# EAGLE design budzik (EAGLE 7.7.0)
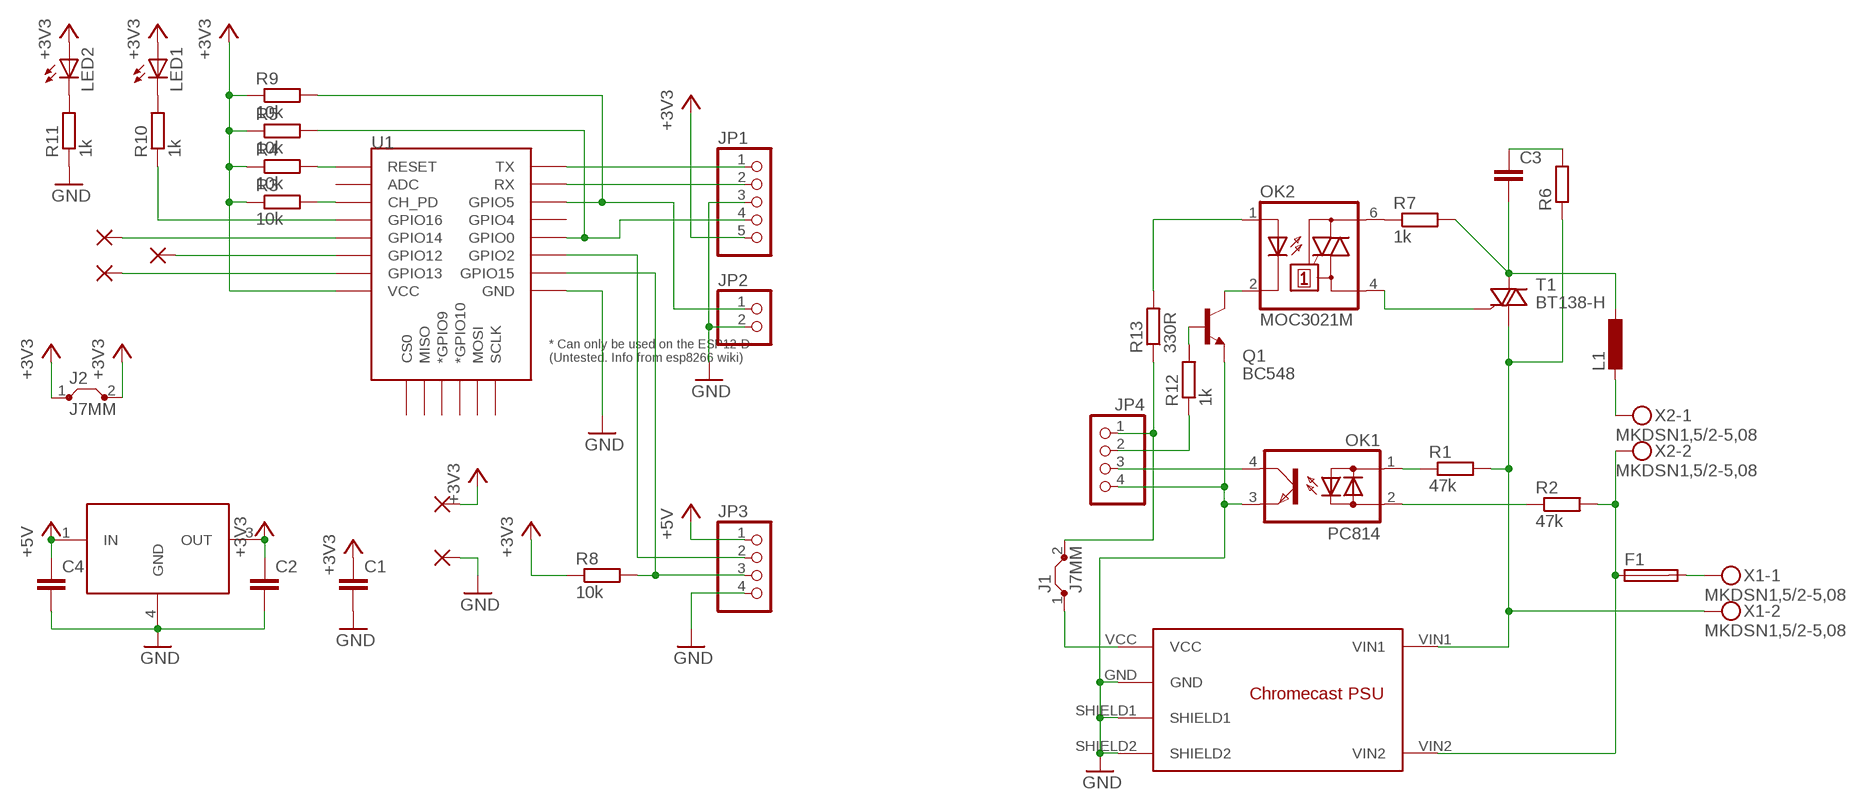
[diagram p0: schematic, sheet 1]

## Parts
C1  C-EUC1206  [C1206]
C2  C-EUC1206K  [C1206K]
C3  C-EU075-063X106  [C075-063X106]
C4  C-EUC1206K  [C1206K]
F1  TR5  [TR5]
J1  J7MM  [07]
J2  J7MM  [07]
JP1  PINHD-1X5  [1X05]
JP2  PINHD-1X2  [1X02]
JP3  PINHD-1X4  [1X04]
JP4  PINHD-1X4  [1X04]
L1  L-EU6000-XXX-RC  [6000-XXXX-RC]
LED1  LEDSML0805  [SML0805]
LED2  LEDSML0805  [SML0805]
OK1  PC814  [DIL04]
OK2  MOC3021M  [DIL06]
PAD1  WIREPAD2,15/1,0  [2,15/1,0]
PAD2  WIREPAD2,15/1,0  [2,15/1,0]
PAD3  WIREPAD2,15/1,0  [2,15/1,0]
PAD4  WIREPAD2,15/1,0  [2,15/1,0]
PAD5  WIREPAD2,15/1,0  [2,15/1,0]
Q1  BC548  [TO92-EBC]
R1  47k  R-EU_0204/7  [0204/7]
R2  47k  R-EU_0204/7  [0204/7]
R3  10k  R-EU_R0805  [R0805]
R4  10k  R-EU_R0805  [R0805]
R5  10k  R-EU_R0805  [R0805]
R6  R-EU_0411/3V  [0411V]
R7  1k  R-EU_0204/7  [0204/7]
R8  10k  R-EU_R0805  [R0805]
R9  10k  R-EU_R0805  [R0805]
R10  1k  R-EU_R0805  [R0805]
R11  1k  R-EU_R0805  [R0805]
R12  1k  R-EU_R0805  [R0805]
R13  330R  R-EU_R0805  [R0805]
T1  BT138-H  [TO220BH]
U1  ESP12ESMD  [ESP12E-SMD]
U$1  CHROMECAST-PSU  [CHROMECAST-PSU-UPSIDE-DOWN]
U$2  LF33A  [DPAK]
X1  MKDSN1,5/2-5,08  [MKDSN1,5/2-5,08]
X2  MKDSN1,5/2-5,08  [MKDSN1,5/2-5,08]

## Nets
+3V3: C1.1 C2.1 J2.1 J2.2 JP1.5 LED1.A LED2.A PAD4.1(P) R3.1 R4.1 R5.1 R8.1 R9.1 U1.VCC U$2.3(OUT)
+5V: C4.1 JP3.1 U$2.1(IN)
GND: C1.2 C2.2 C4.2 JP1.3 JP2.2 JP3.4 JP4.4 OK1.3(E) PAD5.1(P) Q1.E R11.1 U1.GND U$1.GND U$1.SHIELD1 U$1.SHIELD2 U$2.4(GND)
N$1: C3.2 L1.1 R7.2 T1.T2(A2)
N$2: OK2.4(A1) T1.G
N$3: F1.2 X1.1
N$4: R1.2 R6.1 T1.T1(A1) U$1.VIN1 X1.2
N$5: OK1.1(AC1) R1.1
N$6: OK1.2(AC2) R2.1
N$7: JP1.1 U1.TXD0(TX)
N$8: JP1.2 U1.RXD0(RX)
N$9: R3.2 U1.CH_PD
N$10: JP1.4 R5.2 U1.GPIO0
N$11: R4.2 U1.RESET
N$12: F1.1 R2.2 U$1.VIN2 X2.2
N$13: JP4.3 OK1.4(C)
N$14: JP3.3 R8.2 U1.GPIO15
N$15: J1.2 JP4.1 R13.1
N$16: C3.1 R6.2
N$17: OK2.6(A2) R7.1
N$18: OK2.2(C) Q1.C
N$19: L1.2 X2.1
N$20: OK2.1(A) R13.2
N$21: JP2.1 R9.2 U1.GPIO5
N$22: PAD1.1(P) U1.GPIO13
N$23: PAD2.1(P) U1.GPIO14
N$24: PAD3.1(P) U1.GPIO12
N$25: LED1.C R10.2
N$26: R10.1 U1.GPIO16
N$27: LED2.C R11.2
N$28: JP4.2 R12.1
N$29: Q1.B R12.2
N$30: JP3.2 U1.GPIO2
N$31: J1.1 U$1.VCC
Unconnected: U1.ADC U1.CS0 U1.GPIO4 U1.GPIO9(*GPIO9) U1.GPIO10(*GPIO10) U1.MISO U1.MOSI U1.SCLK

## Library data of the parts
C1 C2 C4 = rcl:C-EU: CAPACITOR, European symbol
C3 = resistor:C-EU: CAPACITOR, European symbol
F1 = fuse:TR5: FUSE Wickmann; OC_FARNELL: unknown; OC_NEWARK: unknown
J1 J2 = jumper:J: Bridge
JP1 = pinhead:PINHD-1X5: PIN HEADER
JP2 = pinhead:PINHD-1X2: PIN HEADER
JP3 JP4 = pinhead:PINHD-1X4: PIN HEADER
L1 = rcl:L-EU: INDUCTOR, European symbol
LED1 LED2 = led:LED: LED OSRAM: - CHIPLED LG R971, LG N971, LY N971, LG Q971, LY Q971, LO R971, LY R971 LH N974, LH R974 LS Q976, LO Q976, LY Q976 LO Q996 - Hyper CHIPLED LW Q18S LB Q993, LB Q99A, LB R99A - SideLED LS A670, LO A670, LY A670, LG A670, LP A670 LB A673, LV A673, LT A673, LW A673 LH A674 LY A675 LS A676, LA A676, LO A676, LY A676, LW A676 LS A679, LY A679, LG A679 - Hyper Micro SIDELED® LS Y876, LA Y876, LO Y876, LY Y876 LT Y87S - SmartLED LW L88C, LW L88S LB L89C, LB L89S, LG L890 LS L89K, LO L89K, LY L89K LS L896, LA L896, LO L896, LY L896 - TOPLED LS T670, LO T670, LY T670, LG T670, LP T670 LSG T670, LSP T670, LSY T670, LOP T670, LYG T670 LG T671, LOG T671, LSG T671 LB T673, LV T673, LT T673, LW T673 LH T674 LS T676, LA T676, LO T676, LY T676, LB T676, LH T676, LSB T676, LW T676 LB T67C, LV T67C, LT T67C, LS T67K, LO T67K, LY T67K, LW E67C LS E67B, LA E67B, LO E67B, LY E67B, LB E67C, LV E67C, LT E67C LW T67C LS T679, LY T679, LG T679 LS T770, LO T770, LY T770, LG T770, LP T770 LB T773, LV T773, LT T773, LW T773 LH T774 LS E675, LA E675, LY E675, LS T675 LS T776, LA T776, LO T776, LY T776, LB T776 LHGB T686 LT T68C, LB T68C - Hyper Mini TOPLED® LB M676 - Mini TOPLED Santana® LG M470 LS M47K, LO M47K, LY M47K Source: http://www.osram.convergy.de LUXEON: - LUMILED® LXK2-PW12-R00, LXK2-PW12-S00, LXK2-PW14-U00, LXK2-PW14-V00 LXK2-PM12-R00, LXK2-PM12-S00, LXK2-PM14-U00 LXK2-PE12-Q00, LXK2-PE12-R00, LXK2-PE12-S00, LXK2-PE14-T00, LXK2-PE14-U00 LXK2-PB12-K00, LXK2-PB12-L00, LXK2-PB12-M00, LXK2-PB14-N00, LXK2-PB14-P00, LXK2-PB14-Q00 LXK2-PR12-L00, LXK2-PR12-M00, LXK2-PR14-Q00, LXK2-PR14-R00 LXK2-PD12-Q00, LXK2-PD12-R00, LXK2-PD12-S00 LXK2-PH12-R00, LXK2-PH12-S00 LXK2-PL12-P00, LXK2-PL12-Q00, LXK2-PL12-R00 Source: www.luxeon.com KINGBRIGHT: KA-3528ASYC Source: www.kingbright.com
OK1 = optocoupler:PC814: SHARP OPTO COUPLER; OC_FARNELL: 9707662; OC_NEWARK: unknown
OK2 = optocoupler:MOC30*M: RANDOM-PHASE OPTOISOLATORS TRIAC DRIVER OUTPUT Source: http://www.fairchildsemi.com MOC3020-M.pdf; MF: FAIRCHILD SEMICONDUCTOR; MPN: MOC3021-M; OC_FARNELL: 1021365; OC_NEWARK: 95B7895
PAD1-PAD5 = wirepad:WIREPAD: Wire PAD connect wire on PCB
Q1 = transistor-npn:BC548*: NPN Transistor
R1-R5 R7-R13 = rcl:R-EU_: RESISTOR, European symbol
R6 = resistor:R-EU_: RESISTOR, European symbol
T1 = triac:BT138: TRIAC Source: http://www.semiconductors.philips.com BT138_SERIES_2.pdf
U1 = esp8266modules:ESP12E: ESP12E Module
U$1 = chromecast-psu:CHROMECAST-PSU
U$2 = chromecast-psu:LF33A
X1 X2 = con-phoenix-508:MKDSN1,5/2-5,08: MKDSN 1,5/ 2-5,08 Printklemme Nennstrom: 13,5 A Nennspannung: 250 V Rastermaß: 5,08 mm Polzahl: 2 Anschlussart: Schraubanschluss Montage: Löten Anschlussrichtung Leiter/Platine: 0 ° Artikelnummer: 1729128 Source: http://eshop.phoenixcontact.com .. 1729128.pdf

## Board
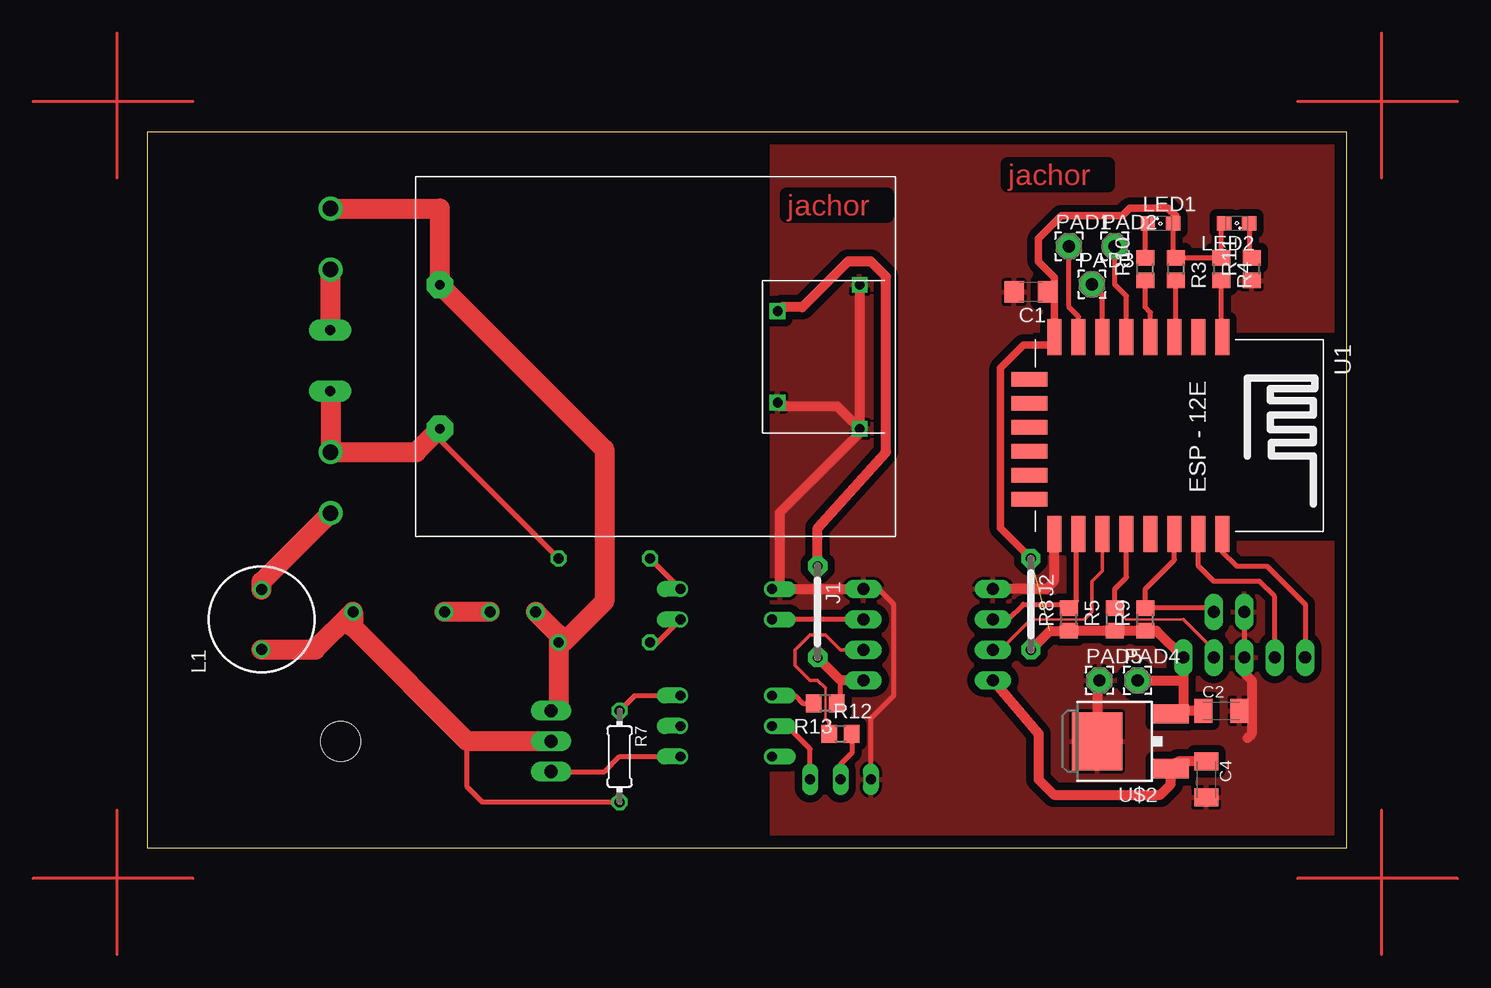
[diagram p1: board, top side]
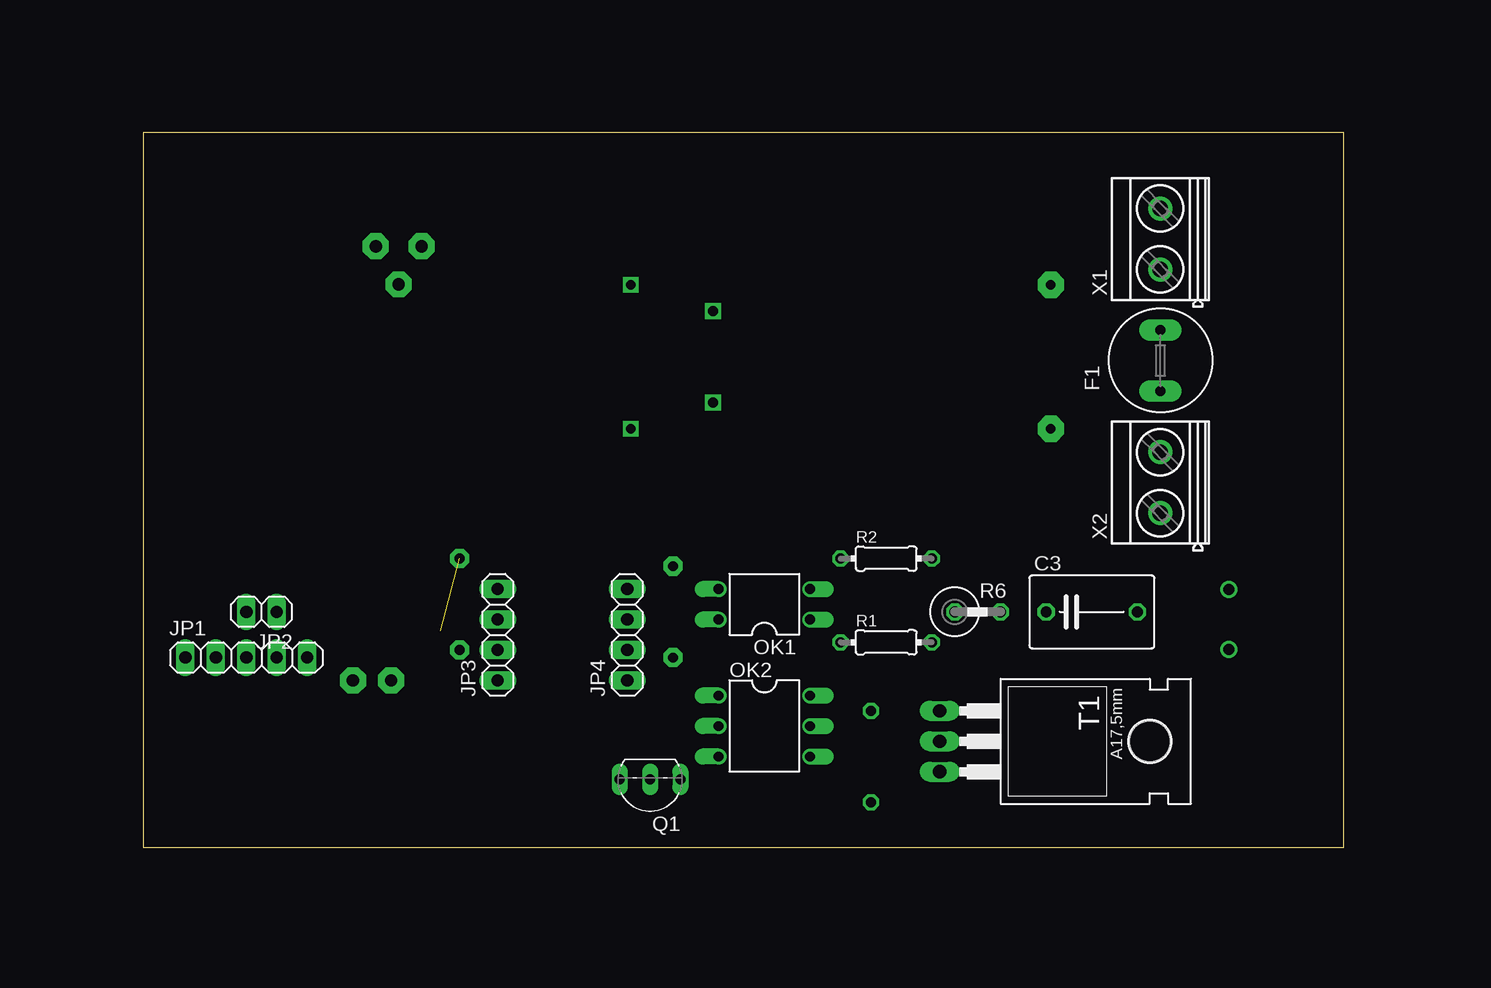
[diagram p2: board, bottom side, seen from below]

Size 100 x 59.68 mm. Coordinates in mm from the lower left corner, seen from the top.
Outline: 0,0 100,0 100,59.68 0,59.68 0,0
Copper layers (1*16): Top 0.035mm / dielectric 1.5mm / Bottom 0.035mm
Design rules "default": minimum track width 10mil, minimum drill 24mil, track to track 8mil, track to pad 8mil, pad to pad 8mil, via to via 8mil, smd to smd 8mil, copper to edge 40mil, drill to drill 8mil, minimum pad ring 10mil, minimum via ring 8mil, stop-mask expansion 4mil, vias tented up to drill 0mil, thermal gap 10mil
tRestrict: area 45.7,0 to 50.8,59.7

### Footprints (pad centres in the part's own frame; a part is rotated, then mirrored left to right if it is on the bottom)
C1206 = smd 1.6 x 1.8: 1 -1.4,0; 2 1.4,0
C1206K = smd 1.5 x 2: 1 -1.5,0; 2 1.5,0
C075-063X106 = drill 0.914 octagon: 1 -3.81,0; 2 3.81,0
TR5 = drill 0.813 pad 1.778 long: 1 -2.54,0; 2 2.54,0
07 = drill 0.813 pad 1.6 octagon: 1 -3.81,0; 2 3.81,0
1X05 = drill 1.016 long: 1 -5.08,0; 2 -2.54,0; 3 0,0; 4 2.54,0; 5 5.08,0
1X02 = drill 1.016 long: 1 -1.27,0; 2 1.27,0
1X04 = drill 1.016 long: 1 -3.81,0; 2 -1.27,0; 3 1.27,0; 4 3.81,0
6000-XXXX-RC = drill 0.9 pad 1.422: 1 -2.5,0; 2 2.5,0
SML0805 = smd 1.2 x 1.2: A 1.05,0; C -1.05,0
DIL04 = drill 0.813 offset: 1 -1.27,-3.81; 2 1.27,-3.81; 3 1.27,3.81; 4 -1.27,3.81
DIL06 = drill 0.813 offset: 1 -2.54,-3.81; 2 0,-3.81; 3 2.54,-3.81; 4 2.54,3.81; 5 0,3.81; 6 -2.54,3.81
2,15/1,0 = drill 1.016 pad 2.159 octagon: 1 0,0
TO92-EBC = drill 0.813 long: B 0,-1.27; C -2.54,-1.27; E 2.54,-1.27
0204/7 = drill 0.813 octagon: 1 -3.81,0; 2 3.81,0
R0805 = smd 1.3 x 1.5: 1 -0.95,0; 2 0.95,0
0411V = drill 0.914 octagon: 1 -2.54,0; 2 1.27,0
TO220BH = drill 1.118 long: G 2.54,-6.35; T1 -2.54,-6.35; T2 0,-6.35 | hole 3.302: 0,11.176
ESP12E-SMD = smd 3 x 1.2: ADC -8.3,3.8; CH_PD -8.3,1.8; GND 8.1,-8.2; GPIO0 8.1,-2.2; GPIO2 8.1,-4.2; GPIO4 8.1,-0.2; GPIO5 8.1,1.8; GPIO12 -8.3,-4.2; GPIO13 -8.3,-6.2; GPIO14 -8.3,-2.2; GPIO15 8.1,-6.2; GPIO16 -8.3,-0.2; RESET -8.3,5.8; RXD0 8.1,3.8; TXD0 8.1,5.8; VCC -8.3,-8.2 | smd 1.2 x 3: CS0 -4.8,-10.3; GPIO9 -0.8,-10.3; GPIO10 1.2,-10.3; MISO -2.8,-10.3; MOSI 3.2,-10.3; SCLK 5.2,-10.3
CHROMECAST-PSU-UPSIDE-DOWN = drill 0.8 square: GND 10.16,-3.81; SHIELD1 17,6; SHIELD2 17,-6; VCC 10.16,3.81 | drill 0.8 pad 2.184 octagon: VIN1 -18,6; VIN2 -18,-6
DPAK = smd 1.6 x 3: 1 -2.28,-4.04; 3 2.28,-4.04 | smd 4.826 x 4.191: 4 0,2.096
MKDSN1,5/2-5,08 = drill 1.3 pad 2: 1 -2.561,0.025; 2 2.519,0.025

### Placement (x,y rotation side)
C1  73.66,46.35 180 top
C2  89.53,11.43 0 top
C3  20.95,19.69 0 bottom
C4  88.27,5.71 270 top
F1  15.24,40.64 90 bottom
J1  55.88,19.69 270 top
J2  73.66,20.32 270 top
JP1  91.44,15.88 0 bottom
JP2  90.17,19.69 180 bottom
JP3  70.48,17.78 90 bottom
JP4  59.69,17.78 90 bottom
L1  9.53,19.05 90 top
LED1  84.45,52.07 0 top
LED2  90.81,52.07 180 top
OK1  48.26,20.32 90 bottom
OK2  48.26,10.16 270 bottom
PAD1  76.83,50.16 0 top
PAD2  80.64,50.16 0 top
PAD3  78.74,46.99 0 top
PAD4  82.55,13.97 0 top
PAD5  79.38,13.97 0 top
Q1  57.78,4.45 180 bottom
R1  38.1,17.15 0 bottom
R2  38.1,24.13 0 bottom
R3  85.72,48.26 270 top
R4  89.53,48.26 270 top
R5  80.64,19.05 90 top
R6  29.84,19.69 0 bottom
R7  39.37,7.62 270 top
R8  76.83,19.05 90 top
R9  83.19,19.05 90 top
R10  83.19,48.26 90 top
R11  92.08,48.26 90 top
R12  57.78,9.52 0 top
R13  56.52,12.06 180 top
T1  27.3,8.89 270 bottom
U1  83.82,34.29 270 top
U$1  42.38,40.95 0 top
U$2  81.28,8.89 90 top
X1  15.24,50.8 90 bottom
X2  15.24,30.48 90 bottom

### Tracks (layer width: path | path; a pad name or v marks a point on that pad's centre or on a via)
+3V3  (1 unrouted)
  Top 0.406: LED1.A 85.5,49.43 R3.1 R4.1 89.53,51.85 LED2.A | C1.1 75.62,46.68 75.62,46.99
  Top 0.61: LED1.A 85.72,52.29 85.72,52.71 85.09,53.34 81.92,53.34 81.28,52.71 76.2,52.71 74.3,50.8 74.3,48.9 75.62,47.57 75.62,46.99 U1.VCC 75.62,41.96 75.56,41.91 73.03,41.91 71.12,40.01 71.12,26.67 J2.1
  Top 0.813: J2.2 75.25,18.1 R8.1 R5.1 R9.1 84.14,18.1 JP1.5 86.36,13.97 | 86.36,13.97 86.36,11.16 U$2.3 85.58,11.43 C2.1 | PAD4.1 86.36,13.97
+5V
  Top 0.813: JP3.1 74.3,9.52 74.3,5.71 75.56,4.45 84.45,4.45 85.32,5.31 U$2.1 85.92,7.21 C4.1
GND
  Top 0.406: JP2.2 JP1.3 | Q1.E 60.33,10.79 62.23,12.7 62.23,20.32 60.96,21.59 JP4.4
  Top 0.813: U1.GND 75.56,26.13 75.56,22.23 74.93,21.59 JP3.4 | PAD5.1 79.18,13.78 U$2.4 | JP1.3 91.44,14.6 92.08,13.97 92.08,9.52 91.71,9.16 | U$1.SHIELD1 U$1.SHIELD2 | U$1.GND 52.54,36.99 52.7,36.83 57.5,36.83 U$1.SHIELD2 | OK1.3 52.7,21.59 | 52.7,21.59 JP4.4 | U$1.SHIELD2 59.38,34.62 52.7,27.94 52.7,21.59
  pour Top (isolate 0.61): 73.66,43.18 101.6,43.18 101.6,60.96 52.07,60.96 52.07,-1.91 101.6,-1.91 101.6,25.4 73.66,25.4
N$1
  Top 0.406: R7.2 27.94,3.81 26.67,5.08 26.67,8.89
  Top 1.676: T1.T2 26.67,8.89 17.14,18.41 C3.2 14.01,16.55 L1.1
N$2
  Top 0.406: T1.G 38.1,6.35 39.37,7.62 OK2.4
N$3
  Top 1.676: X1.1 15.24,48.24 F1.2
N$4
  Top 1.676: X1.2 24.38,53.32 U$1.VIN1 38.1,33.23 38.1,20.56 34.68,17.15 R1.2 | R6.1 34.29,17.78 R1.2 | R1.2 34.29,11.43 T1.T1
N$5
  Top 0.406: R1.1 42.55,17.15 OK1.1
N$6
  Top 0.406: R2.1 OK1.2
N$7
  Top 0.406: U1.TXD0 89.53,26.1 89.53,24.77 90.81,23.49 93.34,23.49 96.52,20.32 JP1.1
N$8
  Top 0.406: JP1.2 93.98,20.95 92.71,22.23 88.9,22.23 87.62,23.51 U1.RXD0
N$9
  Top 0.406: U1.CH_PD 85.72,42.7 R3.2
N$10
  Top 0.229: R5.2 81.59,19.05 86.36,19.05
  Top 0.305: 86.36,19.05 88.9,16.51 JP1.4
  Top 0.406: R5.2 80.64,21.59 81.62,22.56 U1.GPIO0
N$11
  Top 0.406: U1.RESET 89.53,42.67 R4.2
N$12
  Top 0.406: U$1.VIN2 24.38,34.04 R2.2
  Top 1.676: F1.1 15.27,38.1 X2.2 22.43,33 U$1.VIN2
N$13
  Top 0.406: JP4.3 OK1.4
N$14
  Top 0.406: U1.GPIO15 77.62,25.55 77.47,25.4 77.47,20.63 R8.2 76.83,20.32 73.03,20.32 71.75,19.05 JP3.3
N$15
  Top 0.406: R13.1 57.78,12.38 57.78,13.97
  Top 0.813: JP4.1 57.78,13.97 J1.2
N$16
  Top 1.676: R6.2 C3.1
N$17
  Top 0.406: R7.1 40.64,12.7 OK2.6
N$18
  Top 0.406: Q1.C 55.24,8.25 53.34,10.16 OK2.2
N$19
  Top 1.676: L1.2 9.53,22.18 X2.1
N$20
  Top 0.406: OK2.1 53.98,12.7 54.61,12.06 R13.2
N$21
  Top 0.406: U1.GPIO5 85.62,24.02 83.19,21.59 R9.2 88.58,20 JP2.1
N$22
  Top 0.406: U1.GPIO13 77.62,44.3 76.83,45.09 PAD1.1
N$23
  Top 0.406: U1.GPIO14 81.62,46.01 80.64,46.99 PAD2.1
N$24
  Top 0.406: U1.GPIO12 79.62,46.11 PAD3.1
N$25
  Top 0.406: R10.2 83.19,51.85 LED1.C
N$26
  Top 0.406: U1.GPIO16 83.62,44.65 83.19,45.09 R10.1
N$27
  Top 0.406: LED2.C 91.86,49.43 R11.2
N$28
  Top 0.229: 56.52,10.79 56.52,13.34
  Top 0.305: R12.1 56.84,10.48 56.52,10.79 | JP4.2 57.78,16.51 56.52,17.78 55.24,17.78 53.98,16.51 53.98,15.24 55.24,13.97 55.88,13.97 56.52,13.34
N$29
  Top 0.406: R12.2 58.73,7.93 57.78,6.98 Q1.B
N$30
  Top 0.229: 73.66,19.05 78.11,19.05
  Top 0.305: JP3.2 71.12,16.51 73.66,19.05 | 78.11,19.05 78.74,19.69 78.74,22.23 79.62,23.1 U1.GPIO2
N$31
  Top 0.813: J1.1 55.88,26.67 61.59,33.02 61.59,47.62 60.33,48.9 58.42,48.9 54.61,45.09 52.87,45.09 U$1.VCC
N$33
  Top 0.254: -2.54,67.94 -2.54,55.88
N$34
  Top 0.254: 3.81,62.23 -9.53,62.23
N$35
  Top 0.254: 102.87,67.94 102.87,55.88
N$36
  Top 0.254: 109.22,62.23 95.89,62.23
N$37
  Top 0.254: 102.87,3.18 102.87,-8.89
N$38
  Top 0.254: 109.22,-2.54 95.89,-2.54
N$39
  Top 0.254: -2.54,3.18 -2.54,-8.89
N$40
  Top 0.254: 3.81,-2.54 -9.53,-2.54

### Text on the board
Top: jachor | jachor